# EAGLE design tlc5916-2seg (EAGLE 9.3.0)
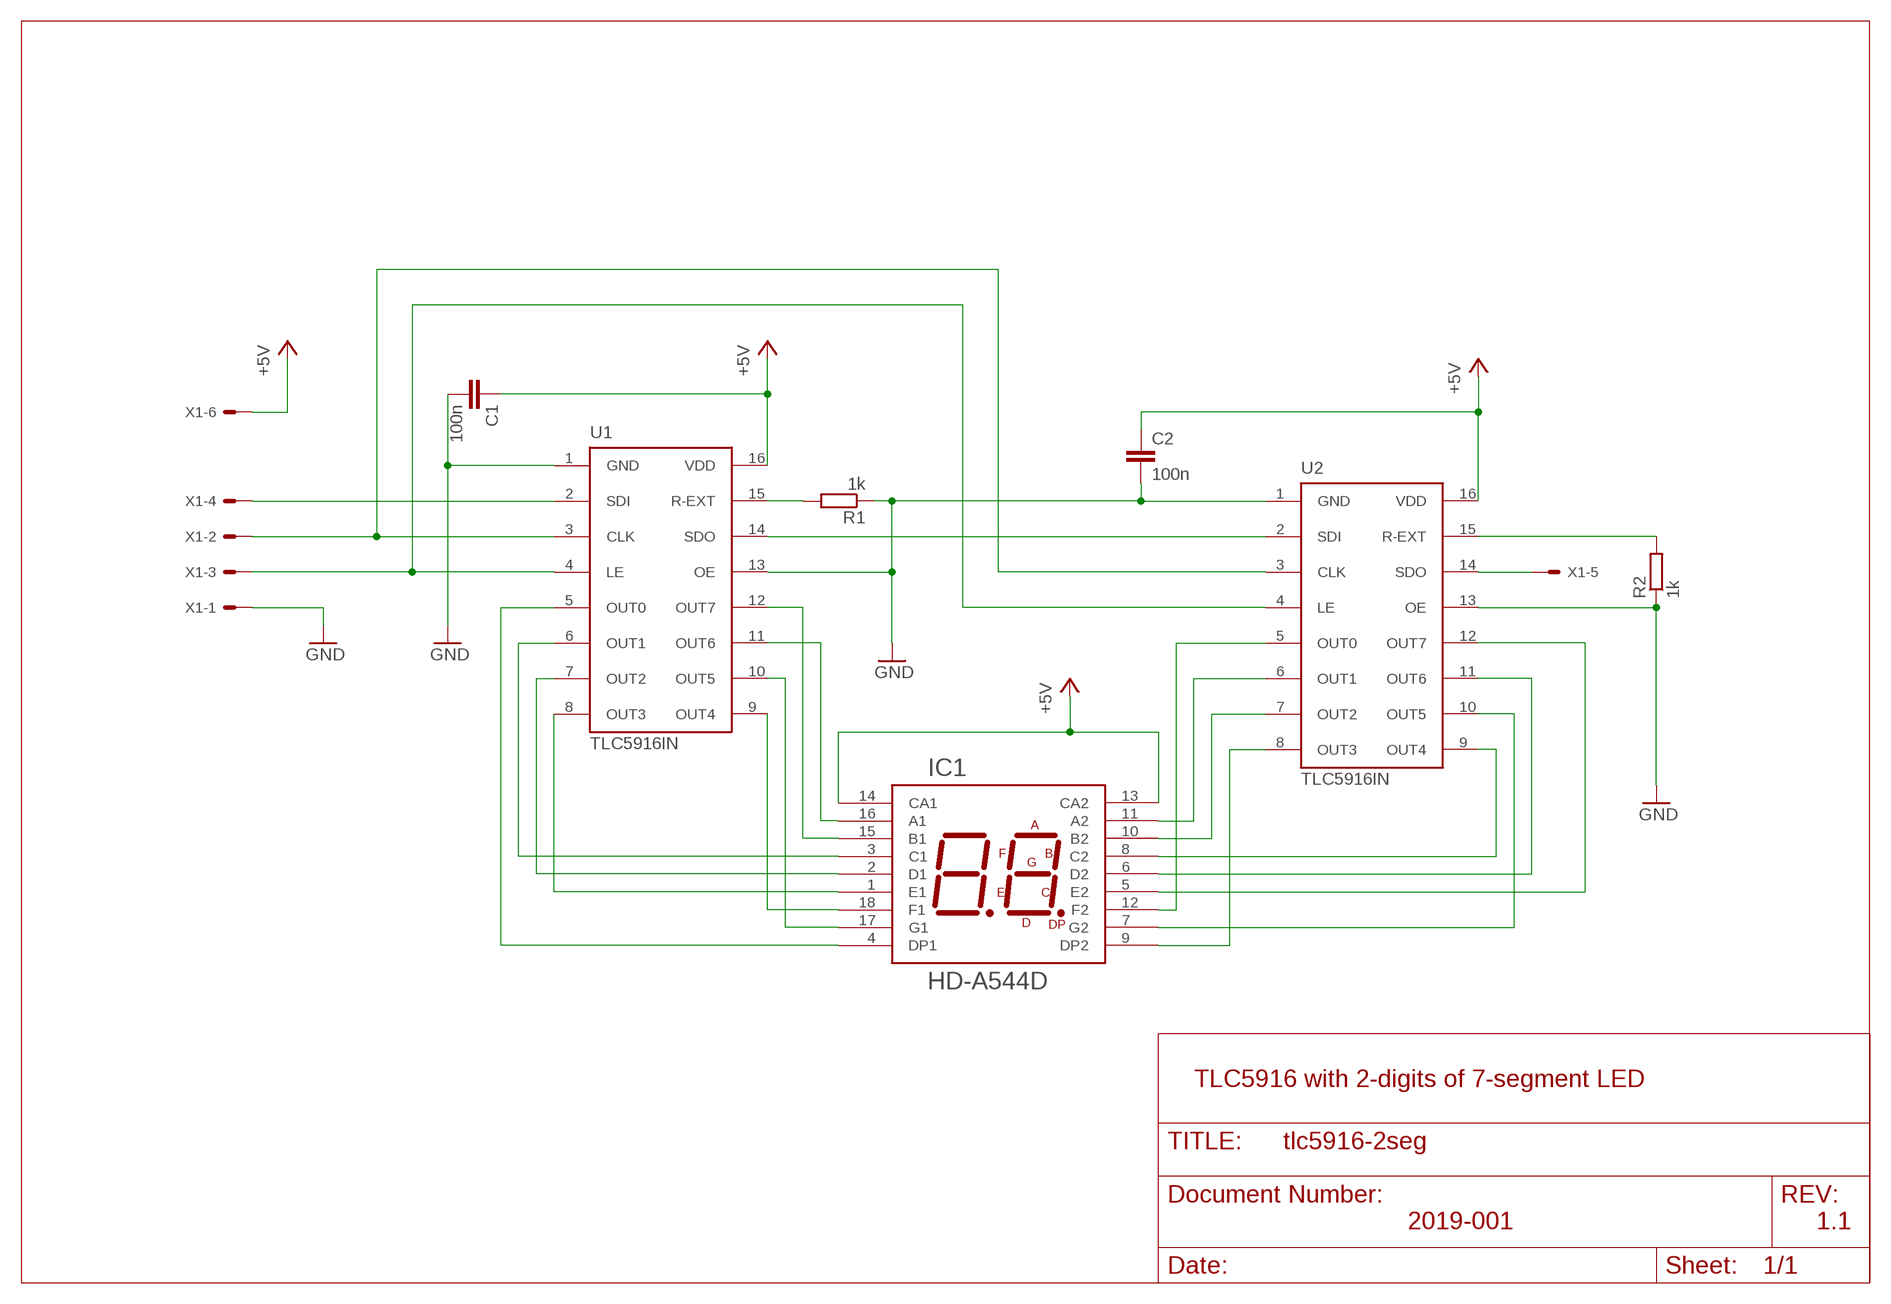
[diagram p0: schematic, sheet 1]
FRAME1 (DINA4_L): DOC_NUMBER: 2019-001; HEADING: TLC5916 with 2-digits of 7-segment LED; REVISION: 1.1

## Parts
C1  100n  C5/3  [C5B3]
C2  100n  C5/3  [C5B3]
IC1  HD-A544D  [DIL18-SE]
R1  1k  R-EU_0207/10  [0207/10]
R2  1k  R-EU_0207/10  [0207/10]
U1  TLC5916IN  [DIL16]
U2  TLC5916IN  [DIL16]
X1  22-23-2061  [22-23-2061]

## Nets
+5V: C1.1 C2.1 IC1.13(CA2) IC1.14(CA1) U1.16(VDD) U2.16(VDD) X1.6
GND: C1.2 C2.2 R1.1 R2.1 U1.1(GND) U1.13(OE) U2.1(GND) U2.13(OE) X1.1
N$1: R1.2 U1.15(R-EXT)
N$2: U1.3(CLK) U2.3(CLK) X1.2
N$3: U1.4(LE) U2.4(LE) X1.3
N$4: U1.2(SDI) X1.4
N$5: U1.14(SDO) U2.2(SDI)
N$6: U2.14(SDO) X1.5
N$7: IC1.15(B1) U1.12(OUT7)
N$8: R2.2 U2.15(R-EXT)
N$9: IC1.16(A1) U1.11(OUT6)
N$10: IC1.17(G1) U1.10(OUT5)
N$11: IC1.18(F1) U1.9(OUT4)
N$12: IC1.1(E1) U1.8(OUT3)
N$13: IC1.2(D1) U1.7(OUT2)
N$14: IC1.3(C1) U1.6(OUT1)
N$15: IC1.4(DP1) U1.5(OUT0)
N$16: IC1.12(F2) U2.5(OUT0)
N$17: IC1.11(A2) U2.6(OUT1)
N$18: IC1.10(B2) U2.7(OUT2)
N$19: IC1.9(DP2) U2.8(OUT3)
N$20: IC1.8(C2) U2.9(OUT4)
N$21: IC1.7(G2) U2.10(OUT5)
N$22: IC1.6(D2) U2.11(OUT6)
N$23: IC1.5(E2) U2.12(OUT7)

## Library data of the parts
C1 C2 = capacitor-wima:C: CAPACITOR naming: grid - package width
IC1 = MOJE:HD-A544D
R1 R2 = rcl:R-EU_: RESISTOR, European symbol; SPICEPREFIX: R
U1 U2 = zlalanne:TLC5916: TLC5916 8-Channel Constant-Current LED Sink Drivers Datasheet <http://www.ti.com/lit/ds/symlink/tlc5916.pdf>
X1 = con-molex:22-23-2061: .100" (2.54mm) Center Header - 6 Pin; MF: MOLEX; MPN: 22-23-2061; OC_FARNELL: 1462922; OC_NEWARK: 27C1933

## Board
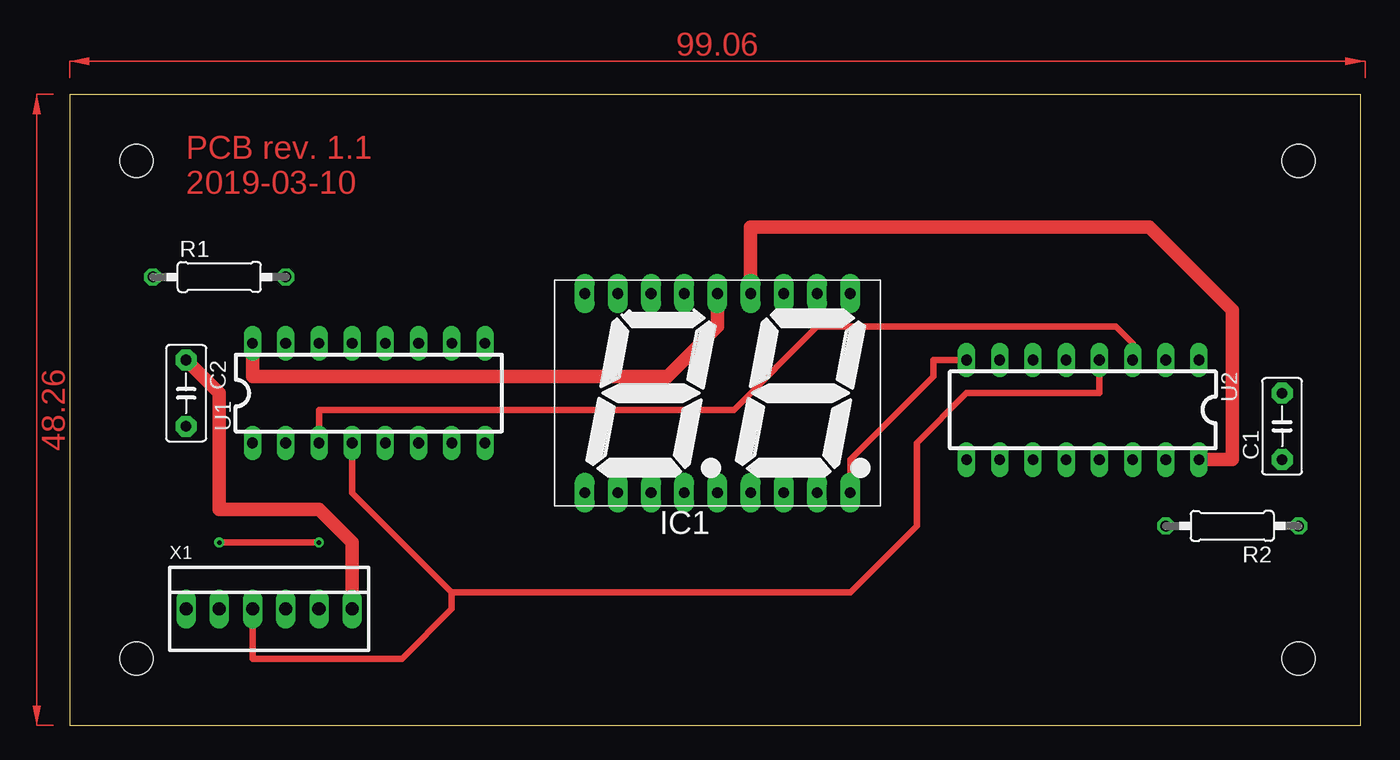
[diagram p1: board, top side]
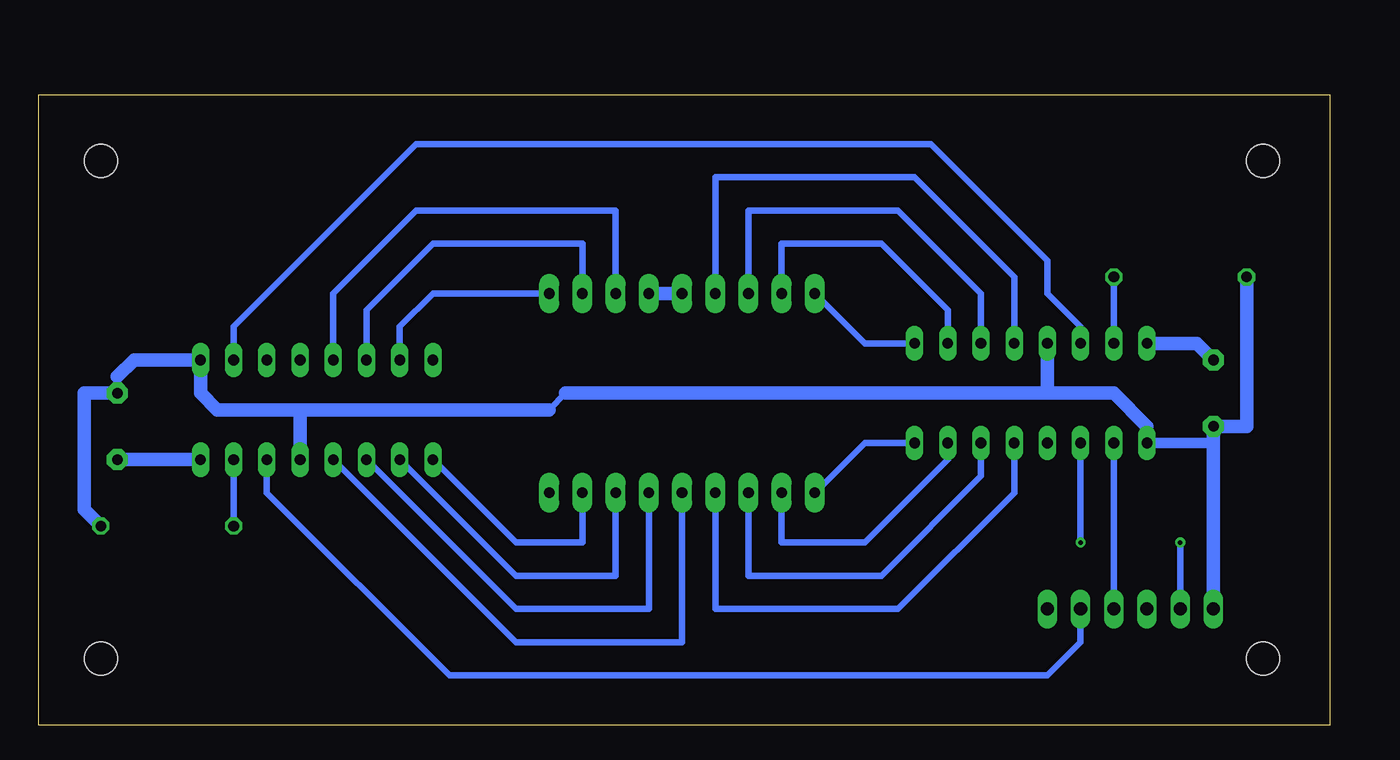
[diagram p2: board, bottom side, seen from below]

Size 98.73 x 48.25 mm. Coordinates in mm from the lower left corner, seen from the top.
Outline: 0,0 98.73,0 98.73,48.25 0,48.25 0,0
Copper layers (1*16): Top 0.035mm / dielectric 1.5mm / Bottom 0.035mm
Design rules "default": minimum track width 6mil, minimum drill 0.35mm, track to track 6mil, track to pad 6mil, pad to pad 6mil, via to via 6mil, smd to smd 6mil, copper to edge 40mil, drill to drill 6mil, minimum pad ring 10mil, minimum via ring 8mil, stop-mask expansion 4mil, vias tented up to drill 0mil, thermal gap 10mil
Holes 2.54 mm at 5.08,43.18 5.08,5.08 93.98,5.08 93.98,43.18

### Footprints (pad centres in the part's own frame; a part is rotated, then mirrored left to right if it is on the bottom)
C5B3 = drill 0.813 pad 1.6 octagon: 1 -2.54,0; 2 2.54,0
DIL18-SE = drill 0.813 pad 1.524 long: 1 -10.16,-7.62; 2 -7.62,-7.62; 3 -5.08,-7.62; 4 -2.54,-7.62; 5 0,-7.62; 6 2.54,-7.62; 7 5.08,-7.62; 8 7.62,-7.62; 9 10.16,-7.62; 10 10.16,7.62; 11 7.62,7.62; 12 5.08,7.62; 13 2.54,7.62; 14 0,7.62; 15 -2.54,7.62; 16 -5.08,7.62; 17 -7.62,7.62; 18 -10.16,7.62
0207/10 = drill 0.813 octagon: 1 -5.08,0; 2 5.08,0
DIL16 = drill 0.813 long: 1 -8.89,-3.81; 2 -6.35,-3.81; 3 -3.81,-3.81; 4 -1.27,-3.81; 5 1.27,-3.81; 6 3.81,-3.81; 7 6.35,-3.81; 8 8.89,-3.81; 9 8.89,3.81; 10 6.35,3.81; 11 3.81,3.81; 12 1.27,3.81; 13 -1.27,3.81; 14 -3.81,3.81; 15 -6.35,3.81; 16 -8.89,3.81
22-23-2061 = drill 1 long: 1 -6.35,0; 2 -3.81,0; 3 -1.27,0; 4 1.27,0; 5 3.81,0; 6 6.35,0

### Placement (x,y rotation side)
C1  92.71,22.86 90 top
C2  8.89,25.4 270 top
IC1  49.53,25.4 0 top
R1  11.43,34.29 0 top
R2  88.9,15.24 180 top
U1  22.86,25.4 0 top
U2  77.47,24.13 180 top
X1  15.24,8.89 0 top

### Tracks (layer width: path | path; a pad name or v marks a point on that pad's centre or on a via)
+5V
  Top 1.016: X1.6 21.59,13.97 19.05,16.51 11.43,16.51 11.43,25.4 C2.1 | IC1.14 49.53,30.48 45.72,26.67 13.97,26.67 U1.16 | U2.16 88.9,20.32 88.9,31.75 82.55,38.1 52.07,38.1 IC1.13
  Bottom 1.016: IC1.13 IC1.14 | C1.1 U2.16 | C2.1 10.16,29.21 U1.16
GND
  Bottom 0.508: U1.1 13.97,22.86 | C1.2 92.71,26.67 | 58.42,25.4 59.69,24.13
  Bottom 0.813: U1.1 8.89,21.59
  Bottom 1.016: R1.1 6.35,22.86 C2.2 8.89,21.59 X1.1 | 13.97,22.86 16.51,25.4 21.59,25.4 | 21.59,25.4 U1.13 | R2.1 95.25,16.51 95.25,25.4 C1.2 | 92.71,26.67 91.44,27.94 U2.1 86.36,25.4 85.09,24.13 78.74,24.13 | 78.74,24.13 U2.13 | 21.59,25.4 58.42,25.4 | 59.69,24.13 78.74,24.13
N$1
  Bottom 0.508: R1.2 U1.15
N$2  (via drill 0.35)
  Top 0.508: v11.43,13.97 v19.05,13.97 | U2.3 81.28,29.21 80.01,30.48 57.15,30.48 50.8,24.13 19.05,24.13 U1.3
  Bottom 0.508: v19.05,13.97 U1.3 | X1.2 v11.43,13.97
N$3
  Top 0.508: U1.4 21.59,17.78 29.21,10.16 | X1.3 13.97,5.08 25.4,5.08 29.21,8.89 29.21,10.16 | U2.4 78.74,25.4 68.58,25.4 64.77,21.59 64.77,15.24 59.69,10.16 29.21,10.16
N$4
  Bottom 0.508: U1.2 X1.4
N$5
  Bottom 0.508: U1.14 19.05,30.48 21.59,33.02 21.59,35.56 30.48,44.45 69.85,44.45 83.82,30.48 U2.2
N$6
  Bottom 0.508: X1.5 19.05,6.35 21.59,3.81 67.31,3.81 81.28,17.78 U2.14
N$7
  Bottom 0.508: U1.12 24.13,34.29 31.75,41.91 46.99,41.91 IC1.15
N$8
  Bottom 0.508: R2.2 U2.15
N$9
  Bottom 0.508: U1.11 26.67,33.02 33.02,39.37 44.45,39.37 IC1.16
N$10
  Bottom 0.508: U1.10 29.21,31.75 34.29,36.83 41.91,36.83 IC1.17
N$11
  Bottom 0.508: U1.9 35.56,29.21 IC1.18
N$12
  Bottom 0.508: U1.8 35.56,21.59 IC1.1
N$13
  Bottom 0.508: U1.7 29.21,20.32 35.56,13.97 41.91,13.97 IC1.2
N$14
  Bottom 0.508: U1.6 26.67,19.05 34.29,11.43 44.45,11.43 IC1.3
N$15
  Bottom 0.508: U1.5 24.13,17.78 33.02,8.89 46.99,8.89 IC1.4
N$16
  Bottom 0.508: IC1.12 54.61,39.37 69.85,39.37 76.2,33.02 U2.5
N$17
  Bottom 0.508: U2.6 73.66,31.75 68.58,36.83 57.15,36.83 IC1.11
N$18
  Bottom 0.508: U2.7 71.12,30.48 68.58,33.02 IC1.10
N$19
  Top 0.508: U2.8 66.04,27.94 66.04,26.67 59.69,20.32 IC1.9
N$20
  Bottom 0.508: U2.9 62.23,13.97 57.15,13.97 IC1.8
N$21
  Bottom 0.508: U2.10 62.23,11.43 54.61,11.43 IC1.7
N$22
  Bottom 0.508: U2.11 62.23,8.89 52.07,8.89 IC1.6
N$23
  Bottom 0.508: U2.12 62.23,6.35 49.53,6.35 IC1.5
(copper drawn outside any net)
  shapes: Top area x2

### Text on the board
Top: PCB rev. 1.1 / 2019-03-10